# Altium project PCB_Project.PrjPcb
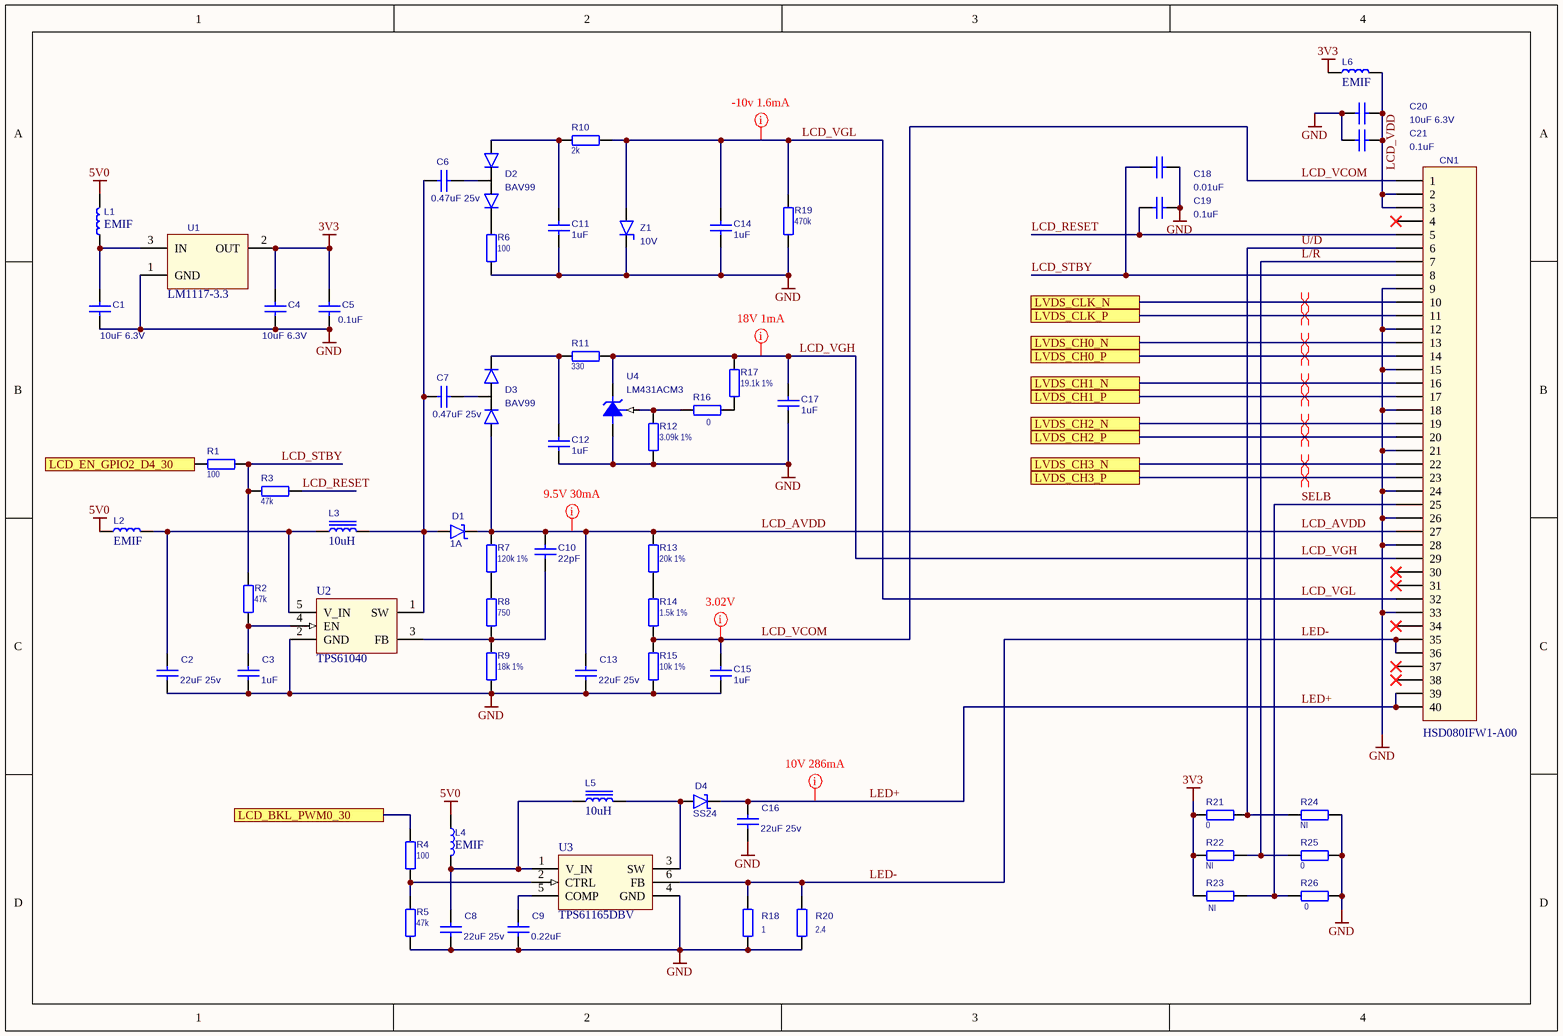
[diagram p0: panel_power_backlight.SchDoc]
4 sheets, 156 parts. Net scope: flat (ports and power ports of the same name join across sheets).
Board file: PCB.PcbDoc
Sheets:
  panel_power_backlight.SchDoc
  mipi_to_lvds.SchDoc
  touch_panel.SchDoc
  mcu_mic_amp_connector.SchDoc

## Sheet panel_power_backlight.SchDoc
size A4

### Parts
C1  value 10uF 6.3V  [C0603]  (hidden comment: CC0603MRX5R5BB106)
C2  value 22uF 25v  [C0805]  (hidden comment: CL21A226MAQNNNE)
C3  value 1uF  [C0603]  (hidden comment: CC0603KRX7R9BB105)
C4  value 10uF 6.3V  [C0603]  (hidden comment: CC0603MRX5R5BB106)
C5  value 0.1uF  [C0603]  (hidden comment: C1608X7R1H104K080AA)
C6  value 0.47uF 25v  [C0603]  (hidden comment: GRM188R71E474KA12D)
C7  value 0.47uF 25v  [C0603]  (hidden comment: GRM188R71E474KA12D)
C8  value 22uF 25v  [C0805]  (hidden comment: CL21A226MAQNNNE)
C9  value 0.22uF  [C0603]  (hidden comment: CC0603ZRY5V8BB224)
C10  value 22pF  [C0603]  (hidden comment: CL10C220JB8NNNC)
C11  value 1uF  [C0603]  (hidden comment: CC0603KRX7R9BB105)
C12  value 1uF  [C0603]  (hidden comment: CC0603KRX7R9BB105)
C13  value 22uF 25v  [C0805]  (hidden comment: CL21A226MAQNNNE)
C14  value 1uF  [C0603]  (hidden comment: CC0603KRX7R9BB105)
C15  value 1uF  [C0603]  (hidden comment: CC0603KRX7R9BB105)
C16  value 22uF 25v  [C0805]  (hidden comment: CL21A226MAQNNNE)
C17  value 1uF  [C0603]  (hidden comment: CC0603KRX7R9BB105)
C18  value 0.01uF  [C0603]  (hidden comment: CL10B103KB8NNNC)
C19  value 0.1uF  [C0603]  (hidden comment: C1608X7R1H104K080AA)
C20  value 10uF 6.3V  [C0603]  (hidden comment: CC0603MRX5R5BB106)
C21  value 0.1uF  [C0603]  (hidden comment: C1608X7R1H104K080AA)
CN1  value HSD080IFW1-A00  [40S-0.5SH]  (hidden comment: FH12-40)
D1  value 1A  [SOD-323]  (hidden comment: PMEG2010EJ.115)
D2  value BAV99  [SOT-23-3]  (hidden comment: BAV99.215)
D3  value BAV99  [SOT-23-3]  (hidden comment: BAV99.215)
D4  SS24  [SMA]
L1  value EMIF  [IND0805]  (hidden comment: BLM21PG221SN1D)
L2  value EMIF  [IND0805]  (hidden comment: BLM21PG221SN1D)
L3  value 10uH  [CDRH3D16]  (hidden comment: CDRH3D16NP-100NC)
L4  value EMIF  [IND0805]  (hidden comment: BLM21PG221SN1D)
L5  value 10uH  [CDRH6D28]  (hidden comment: CDRH6D28-100NC)
L6  value EMIF  [IND0805]  (hidden comment: BLM21PG221SN1D)
R1  100  [R0603]
R2  47k  [R0603]
R3  47k  [R0603]
R4  100  [R0603]
R5  47k  [R0603]
R6  100  [R0603]
R7  value 120k 1%  [R0603]  (hidden comment: 120k)
R8  750  [R0603]
R9  value 18k 1%  [R0603]  (hidden comment: 18k)
R10  2k  [R0603]
R11  330  [R0603]
R12  value 3.09k 1%  [R0603]  (hidden comment: 3.09k)
R13  value 20k 1%  [R0603]  (hidden comment: RC0603FR-0720KL)
R14  value 1.5k 1%  [R0603]  (hidden comment: RC0603FR-071K5L)
R15  value 10k 1%  [R0603]  (hidden comment: RC0603FR-0710KL)
R16  0  [R0603]
R17  19.1k 1%  [R0603]
R18  value 1  [R0805]  (hidden comment: RC0805FR-071RL)
R19  470k  [R0603]
R20  value 2.4  [R0805]  (hidden comment: RES 0805 2R4 5%)
R21  0  [R0603]
R22  value NI  [R0603]  (hidden comment: DNI)
R23  value NI  [R0603]  (hidden comment: DNI)
R24  value NI  [R0603]  (hidden comment: DNI)
R25  0  [R0603]
R26  0  [R0603]
U1  value LM1117-3.3  [SOT-223]  (hidden comment: LM1117)
U2  TPS61040  [SOT-23-5]
U3  value TPS61165DBV  [SOT-23-6]  (hidden comment: TPS61165)
U4  LM431ACM3  [SOT-23-3]
Z1  value 10V  [SOD-80C]  (hidden comment: BZV55-C10.115)

### Ports
LCD_BKL_PWM0_30, LCD_EN_GPIO2_D4_30, LVDS_CH0_N, LVDS_CH0_P, LVDS_CH1_N, LVDS_CH1_P, LVDS_CH2_N, LVDS_CH2_P, LVDS_CH3_N, LVDS_CH3_P, LVDS_CLK_N, LVDS_CLK_P

### Nets
3V3: C4.1 C5.2 L6.1 R21.1 R22.1 R23.1 U1.2(OUT)
5V0: L1.2 L2.2 L4.2
GND: C1.2 C2.1 C3.1 C4.2 C5.1 C8.1 C9.1 C11.1 C12.1 C13.1 C14.1 C15.1 C16.1 C17.1 C18.1 C19.1 C20.1 C21.2 CN1.9 CN1.12 CN1.15 CN1.18 CN1.21 CN1.24 CN1.26 CN1.28 CN1.33 R5.1 R6.2 R9.1 R12.1 R15.1 R18.1 R19.1 R20.1 R24.2 R25.2 R26.2 U1.1(GND) U2.2(GND) U3.4(GND) U4.3(A) Z1.2(K)
L/R: CN1.7 R22.2 R25.1
LCD_AVDD: C10.1 C13.2 CN1.27 D1.2(K) D3.1(A) R7.2 R13.2
LCD_BKL_PWM0_30: R4.2 ; port LCD_BKL_PWM0_30
LCD_EN_GPIO2_D4_30: R1.2 ; port LCD_EN_GPIO2_D4_30
LCD_RESET: C19.2 CN1.5 R3.1
LCD_STBY: C18.2 CN1.8 R1.1 R2.2 R3.2
LCD_VCOM: C15.2 CN1.1 R14.1 R15.2
LCD_VDD: C20.2 C21.1 CN1.2 CN1.3 L6.2
LCD_VGH: C17.2 CN1.29 R11.2 R17.2 U4.1(K)
LCD_VGL: C14.2 CN1.32 R10.2 R19.2 Z1.1(A)
LED+: C16.2 CN1.39 CN1.40 D4.2(K)
LED-: CN1.35 CN1.36 R18.2 R20.2 U3.6(FB)
LVDS_CH0_N: CN1.13 ; port LVDS_CH0_N
LVDS_CH0_P: CN1.14 ; port LVDS_CH0_P
LVDS_CH1_N: CN1.16 ; port LVDS_CH1_N
LVDS_CH1_P: CN1.17 ; port LVDS_CH1_P
LVDS_CH2_N: CN1.19 ; port LVDS_CH2_N
LVDS_CH2_P: CN1.20 ; port LVDS_CH2_P
LVDS_CH3_N: CN1.22 ; port LVDS_CH3_N
LVDS_CH3_P: CN1.23 ; port LVDS_CH3_P
LVDS_CLK_N: CN1.10 ; port LVDS_CLK_N
LVDS_CLK_P: CN1.11 ; port LVDS_CLK_P
SELB: CN1.25 R23.2 R26.1
U/D: CN1.6 R21.2 R24.1
NetC1_1: C1.1 L1.1 U1.3(IN)
NetC2_2: C2.2 L2.1 L3.1 U2.5(V_IN)
NetC3_2: C3.2 R2.1 U2.4(EN)
NetC6_1: C6.1 D2.3(A+K)
NetC6_2: C6.2 C7.2 D1.1(A) L3.2 U2.1(SW)
NetC7_1: C7.1 D3.3(A+K)
NetC8_2: C8.2 L4.1 L5.1 U3.1(V_IN)
NetC9_2: C9.2 U3.5(COMP)
NetC10_2: C10.2 R8.1 R9.2 U2.3(FB)
NetC11_2: C11.2 D2.1(A) R10.1
NetC12_2: C12.2 D3.2(K) R11.1
NetD2_2: D2.2(K) R6.1
NetD4_1: D4.1(A) L5.2 U3.3(SW)
NetR4_1: R4.1 R5.2 U3.2(CTRL)
NetR7_1: R7.1 R8.2
NetR12_2: R12.2 R16.2 U4.2(REF)
NetR13_1: R13.1 R14.2
NetR16_1: R16.1 R17.1

Not connected (* = marked no-connect by the designer): CN1 4* 30* 31* 34* 37* 38*

### Layout directives
mark named 10V 286mA: LED+
mark named 9.5V 30mA: LCD_AVDD
mark named -10v 1.6mA: LCD_VGL
mark named 18V 1mA: LCD_VGH
mark named 3.02V: LCD_VCOM
differential pair: LVDS_CH0_N, LVDS_CH0_P, LVDS_CH1_N, LVDS_CH1_P, LVDS_CH2_N, LVDS_CH2_P, LVDS_CH3_N, LVDS_CH3_P, LVDS_CLK_N, LVDS_CLK_P

### Library data of the parts
C1-C21 = CAP_NPOL
CN1 = FH12-40: DT38
D1 D4 = SHOTTKY
  D4: Value: SS24
D2 D3 = DIODE_DUAL_1: Dual series 1
L1 L2 L4 L6 = IND_WO_IRON
L3 L5 = IND_W_IRON
R1 R4 = RESISTOR: Value: 100
R2 R3 R5-R26 = RESISTOR: RES
  R2 R3 R5: Value: 47k
  R6: Value: 100
  R8: Value: 750
  R10: Value: 2k
  R11: Value: 330
  R16 R21 R25 R26: Value: 0
  R17: Value: 19.1k 1%
  R19: Value: 470k
U2 = TPS6104x
U3 = TPS61165DBV: TPS61165DBV (SOT-23-6 package)
U4 = LM431ACM3: Adjustable Precision Zener Shunt Regulator, 3-pin SOT-23; Manufacturer: National Semiconductor; PackageTopMarking: N1F*XTT; PowerWise: N; CompType: MiscPower; Published: 4-Dec-2008; DatasheetVersion: Mar-2005; PackageVersion: revB, Mar-2003; PackageReference: MF03A; Publisher: Altium Limited; PackageDescription: Molded SOT-23, .115 x .051 x .037in Body, 3 Lead, .075 in Pitch; Supplier 1: Farnell; Supplier Part Number 1: 1215209; PartNumber: LM431ACM3; RoHS: N; PinCount: 3; ComponentLink1Description: LM431 Datasheet; ComponentLink1URL: http://www.national.com/ds/LM/LM431.pdf; ComponentLink2Description: LM431 Web Page; ComponentLink2URL: http://www.national.com/pf/LM/LM431.html; ComponentLink3Description: MF03A Package Page; ComponentLink3URL: http://www.national.com/packaging/folders/mf03a.html
Z1 = ZENNER

## Sheet mipi_to_lvds.SchDoc
size A4
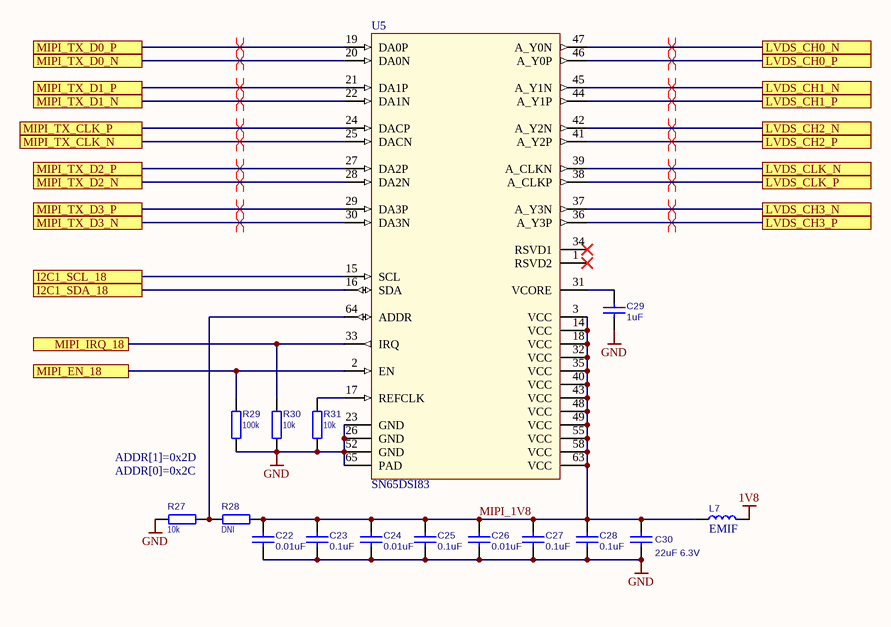
[diagram p1: mipi_to_lvds.SchDoc]

### Parts
C22  value 0.01uF  [C0603]  (hidden comment: CL10B103KB8NNNC)
C23  value 0.1uF  [C0603]  (hidden comment: C1608X7R1H104K080AA)
C24  value 0.01uF  [C0603]  (hidden comment: CL10B103KB8NNNC)
C25  value 0.1uF  [C0603]  (hidden comment: C1608X7R1H104K080AA)
C26  value 0.01uF  [C0603]  (hidden comment: CL10B103KB8NNNC)
C27  value 0.1uF  [C0603]  (hidden comment: C1608X7R1H104K080AA)
C28  value 0.1uF  [C0603]  (hidden comment: C1608X7R1H104K080AA)
C29  value 1uF  [C0603]  (hidden comment: CL21B105KAFNNNE)
C30  value 22uF 6.3V  [C0805]  (hidden comment: CL21A226MQQNNNE)
L7  value EMIF  [IND0805]  (hidden comment: BLM21PG221SN1D)
R27  10k  [R0603]
R28  DNI  [R0603]
R29  value 100k  [R0603]  (hidden comment: 10k)
R30  10k  [R0603]
R31  10k  [R0603]
U5  SN65DSI83  [HPM064_N]

### Ports
I2C1_SCL_18, I2C1_SDA_18, LVDS_CH0_N, LVDS_CH0_P, LVDS_CH1_N, LVDS_CH1_P, LVDS_CH2_N, LVDS_CH2_P, LVDS_CH3_N, LVDS_CH3_P, LVDS_CLK_N, LVDS_CLK_P, MIPI_EN_18, MIPI_IRQ_18, MIPI_TX_CLK_N, MIPI_TX_CLK_P, MIPI_TX_D0_N, MIPI_TX_D0_P, MIPI_TX_D1_N, MIPI_TX_D1_P, MIPI_TX_D2_N, MIPI_TX_D2_P, MIPI_TX_D3_N, MIPI_TX_D3_P

### Nets
1V8: L7.2
GND: C22.2 C23.1 C24.2 C25.1 C26.2 C27.1 C28.1 C29.1 C30.1 R27.1 R29.1 R30.1 R31.1 U5.23(GND) U5.26(GND) U5.52(GND) U5.65(PAD)
I2C1_SCL_18: U5.15(SCL) ; port I2C1_SCL_18
I2C1_SDA_18: U5.16(SDA) ; port I2C1_SDA_18
LVDS_CH0_N: U5.47(A_Y0N) ; port LVDS_CH0_N
LVDS_CH0_P: U5.46(A_Y0P) ; port LVDS_CH0_P
LVDS_CH1_N: U5.45(A_Y1N) ; port LVDS_CH1_N
LVDS_CH1_P: U5.44(A_Y1P) ; port LVDS_CH1_P
LVDS_CH2_N: U5.42(A_Y2N) ; port LVDS_CH2_N
LVDS_CH2_P: U5.41(A_Y2P) ; port LVDS_CH2_P
LVDS_CH3_N: U5.37(A_Y3N) ; port LVDS_CH3_N
LVDS_CH3_P: U5.36(A_Y3P) ; port LVDS_CH3_P
LVDS_CLK_N: U5.39(A_CLKN) ; port LVDS_CLK_N
LVDS_CLK_P: U5.38(A_CLKP) ; port LVDS_CLK_P
MIPI_1V8: C22.1 C23.2 C24.1 C25.2 C26.1 C27.2 C28.2 C30.2 L7.1 R28.2 U5.3(VCC) U5.14(VCC) U5.18(VCC) U5.32(VCC) U5.35(VCC) U5.40(VCC) U5.43(VCC) U5.48(VCC) U5.49(VCC) U5.55(VCC) U5.58(VCC) U5.63(VCC)
MIPI_EN_18: R29.2 U5.2(EN) ; port MIPI_EN_18
MIPI_IRQ_18: R30.2 U5.33(IRQ) ; port MIPI_IRQ_18
MIPI_TX_CLK_N: U5.25(DACN) ; port MIPI_TX_CLK_N
MIPI_TX_CLK_P: U5.24(DACP) ; port MIPI_TX_CLK_P
MIPI_TX_D0_N: U5.20(DA0N) ; port MIPI_TX_D0_N
MIPI_TX_D0_P: U5.19(DA0P) ; port MIPI_TX_D0_P
MIPI_TX_D1_N: U5.22(DA1N) ; port MIPI_TX_D1_N
MIPI_TX_D1_P: U5.21(DA1P) ; port MIPI_TX_D1_P
MIPI_TX_D2_N: U5.28(DA2N) ; port MIPI_TX_D2_N
MIPI_TX_D2_P: U5.27(DA2P) ; port MIPI_TX_D2_P
MIPI_TX_D3_N: U5.30(DA3N) ; port MIPI_TX_D3_N
MIPI_TX_D3_P: U5.29(DA3P) ; port MIPI_TX_D3_P
NetC29_2: C29.2 U5.31(VCORE)
NetR27_2: R27.2 R28.1 U5.64(ADDR)
NetR31_2: R31.2 U5.17(REFCLK)

Not connected (* = marked no-connect by the designer): U5 1(RSVD2)* 34(RSVD1)*

### Layout directives
differential pair: LVDS_CH0_N, LVDS_CH0_P, LVDS_CH1_N, LVDS_CH1_P, LVDS_CH2_N, LVDS_CH2_P, LVDS_CH3_N, LVDS_CH3_P, LVDS_CLK_N, LVDS_CLK_P, MIPI_TX_CLK_N, MIPI_TX_CLK_P, MIPI_TX_D0_N, MIPI_TX_D0_P, MIPI_TX_D1_N, MIPI_TX_D1_P, MIPI_TX_D2_N, MIPI_TX_D2_P, MIPI_TX_D3_N, MIPI_TX_D3_P

### Notes on the sheet
- ADDR[1]=0x2D
- ADDR[0]=0x2C

### Library data of the parts
C22-C30 = CAP_NPOL
L7 = IND_WO_IRON
R27-R31 = RESISTOR: RES
  R27 R30 R31: Value: 10k
  R28: Value: DNI
U5 = SN65DSI83: Single-Channel MIPI® DSI to Single-Link LVDS Bridge; value: SN65DSI83

## Sheet touch_panel.SchDoc
size A4
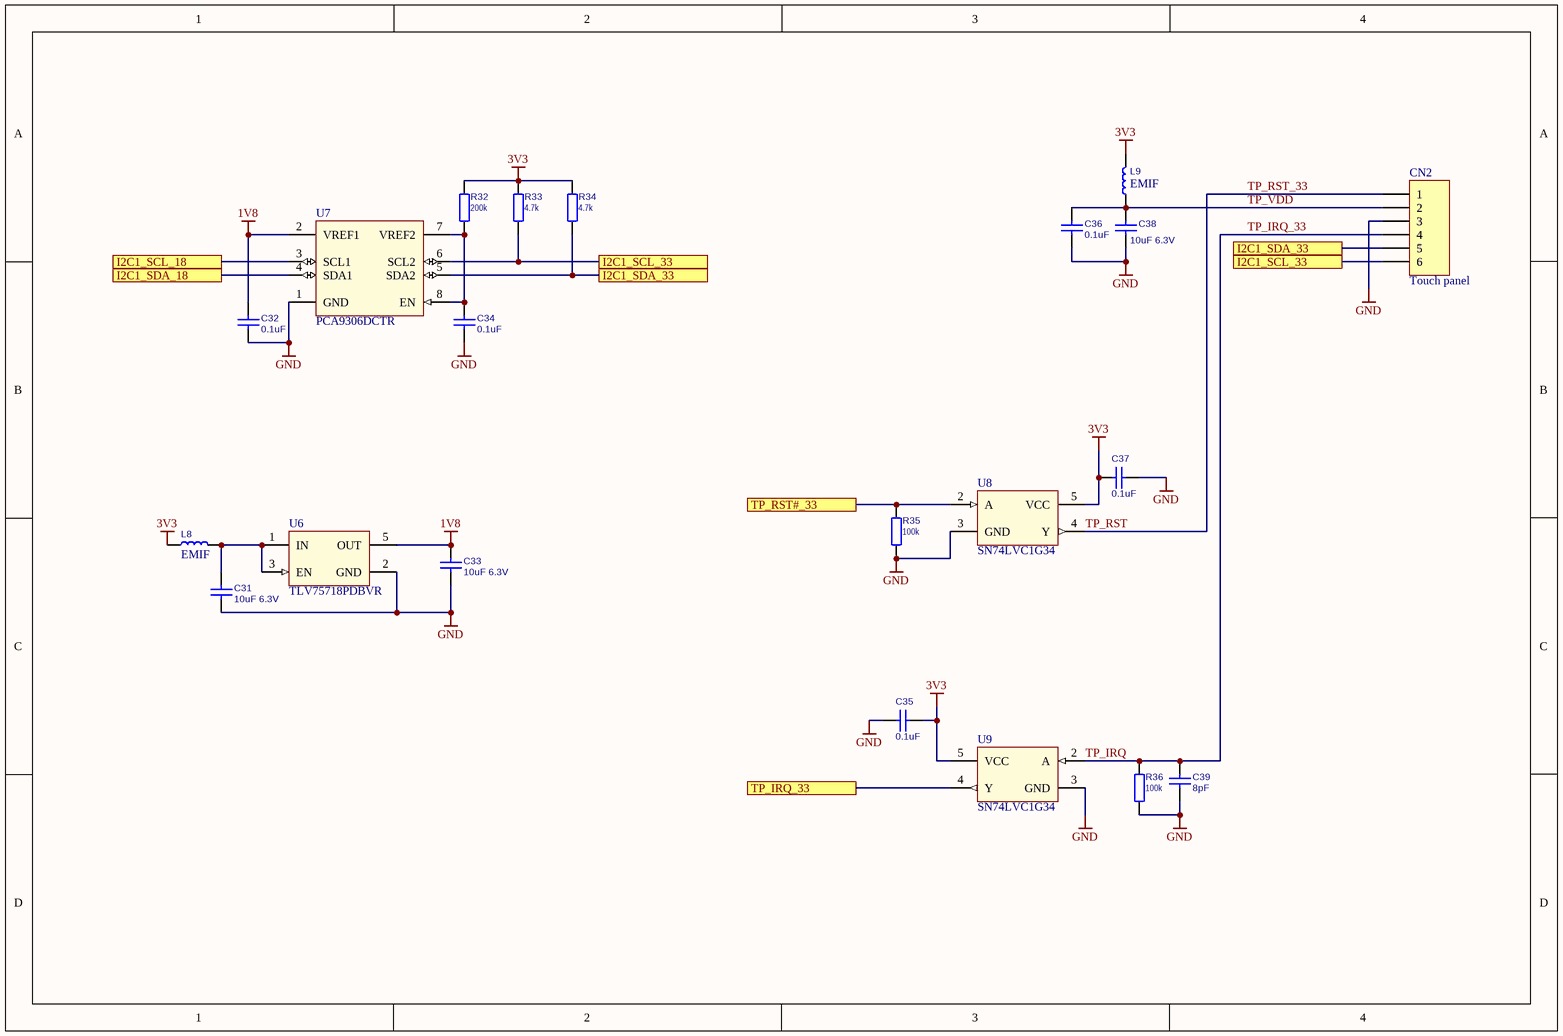
[diagram p2: touch_panel.SchDoc]

### Parts
C31  value 10uF 6.3V  [C0603]  (hidden comment: CC0603MRX5R5BB106)
C32  value 0.1uF  [C0603]  (hidden comment: C1608X7R1H104K080AA)
C33  value 10uF 6.3V  [C0603]  (hidden comment: CC0603MRX5R5BB106)
C34  value 0.1uF  [C0603]  (hidden comment: C1608X7R1H104K080AA)
C35  value 0.1uF  [C0603]  (hidden comment: C1608X7R1H104K080AA)
C36  value 0.1uF  [C0603]  (hidden comment: C1608X7R1H104K080AA)
C37  value 0.1uF  [C0603]  (hidden comment: C1608X7R1H104K080AA)
C38  value 10uF 6.3V  [C0603]  (hidden comment: CC0603MRX5R5BB106)
C39  value 8pF  [C0603]  (hidden comment: GRM1885C1H8R0DA01D)
CN2  Touch panel  [6S-0.5SH]
L8  value EMIF  [IND0603]  (hidden comment: BLM18AG102SN1D)
L9  value EMIF  [IND0603]  (hidden comment: BLM18AG102SN1D)
R32  200k  [R0603]
R33  4.7k  [R0603]
R34  4.7k  [R0603]
R35  value 100k  [R0603]  (hidden comment: 47k)
R36  value 100k  [R0603]  (hidden comment: 47k)
U6  TLV75718PDBVR  [SOT-23-5]
U7  PCA9306DCTR  [PSOP-8]
U8  SN74LVC1G34  [SOT-23-5]
U9  SN74LVC1G34  [SOT-23-5]

### Ports
I2C1_SCL_18, I2C1_SCL_33, I2C1_SDA_18, I2C1_SDA_33, TP_IRQ_33, TP_RST#_33

### Nets
1V8: C32.1 C33.1 U6.5(OUT) U7.2(VREF1)
3V3: C35.1 C37.1 L8.1 L9.2 R32.1 R33.1 R34.1 U8.5(VCC) U9.5(VCC)
GND: C31.2 C32.2 C33.2 C34.1 C35.2 C36.2 C37.2 C38.2 C39.2 CN2.3 R35.1 R36.1 U6.2(GND) U7.1(GND) U8.3(GND) U9.3(GND)
I2C1_SCL_18: U7.3(SCL1) ; port I2C1_SCL_18
I2C1_SCL_33: CN2.6 R33.2 U7.6(SCL2) ; port I2C1_SCL_33
I2C1_SDA_18: U7.4(SDA1) ; port I2C1_SDA_18
I2C1_SDA_33: CN2.5 R34.2 U7.5(SDA2) ; port I2C1_SDA_33
TP_IRQ: C39.1 CN2.4 R36.2 U9.2(A)  [also labelled TP_IRQ_33]
TP_IRQ_33: U9.4(Y) ; port TP_IRQ_33
TP_RST: CN2.1 U8.4(Y)  [also labelled TP_RST_33]
TP_RST#_33: R35.2 U8.2(A) ; port TP_RST#_33
TP_VDD: C36.1 C38.1 CN2.2 L9.1
NetC31_1: C31.1 L8.2 U6.1(IN) U6.3(EN)
NetC34_2: C34.2 R32.2 U7.7(VREF2) U7.8(EN)

### Library data of the parts
C31-C39 = CAP_NPOL
CN2 = Header 6: Header, 6-Pin; LatestRevisionDate: 17-Jul-2002; LatestRevisionNote: Re-released for DXP Platform.; Publisher: Altium Limited
L8 L9 = IND_WO_IRON
R32-R36 = RESISTOR: RES
  R32: Value: 200k
  R33 R34: Value: 4.7k
U6 = TLV733P: Capacitor-Free, 300-mA, Low-Dropout Regulator with Foldback Current Limit for Portable Devices; value: TLV733P
U7 = PCA9306: PCA9306 Dual Bidirectional I2C Bus and SMBus Voltage-Level Translator; value: PCA9306DCTR
U8 U9 = SN74LVC1G34: Single Buffer Gate; value: SN74LVC1G34

## Sheet mcu_mic_amp_connector.SchDoc
size A4
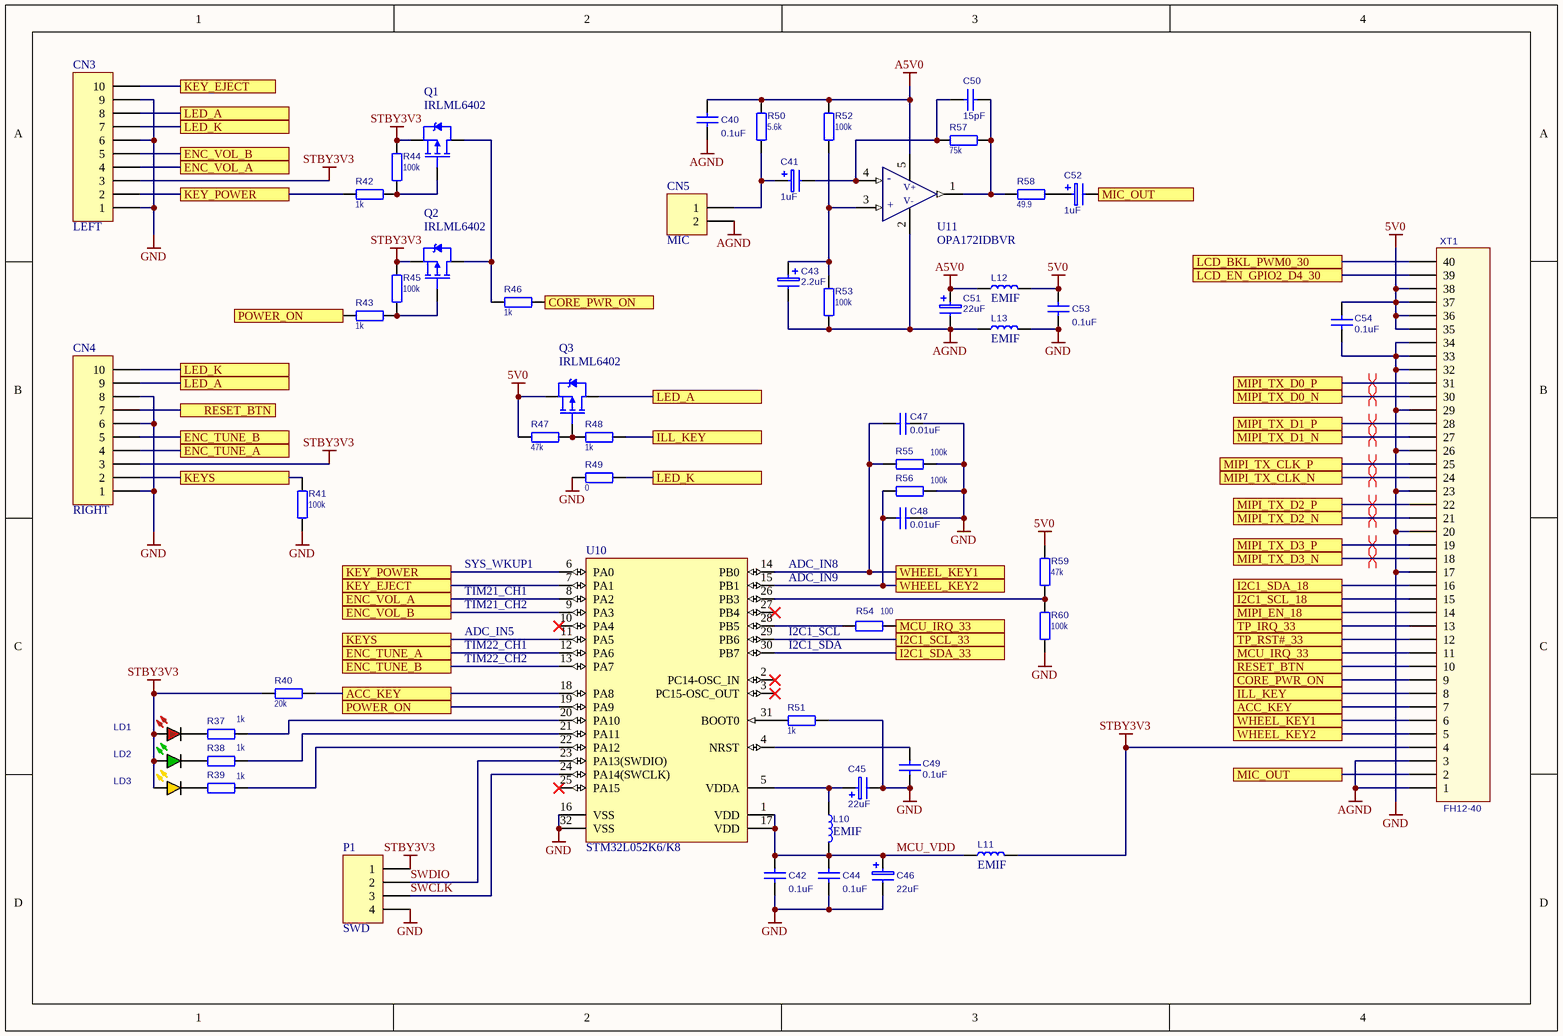
[diagram p3: mcu_mic_amp_connector.SchDoc]

### Parts
C40  value 0.1uF  [C0603]  (hidden comment: CC0603KRX7R9BB104)
C41  value 1uF  [TANTAL-A-1206]  (hidden comment: 293D105X9035A2TE3)
C42  value 0.1uF  [C0603]  (hidden comment: CC0603KRX7R9BB104)
C43  value 2.2uF  [TANTAL-A-1206]  (hidden comment: 293D225X9010A2TE3)
C44  value 0.1uF  [C0603]  (hidden comment: CC0603KRX7R9BB104)
C45  value 22uF  [TANTAL-A-1206]  (hidden comment: 293D226X9010A2TE3)
C46  value 22uF  [TANTAL-A-1206]  (hidden comment: 293D226X9010A2TE3)
C47  value 0.01uF  [C0603]  (hidden comment: CL10B103KB8NNNC)
C48  value 0.01uF  [C0603]  (hidden comment: CL10B103KB8NNNC)
C49  value 0.1uF  [C0603]  (hidden comment: CC0603KRX7R9BB104)
C50  value 15pF  [C0603]  (hidden comment: CC0603GRNPO9BN150)
C51  value 22uF  [TANTAL-A-1206]  (hidden comment: 293D226X9010A2TE3)
C52  value 1uF  [TANTAL-A-1206]  (hidden comment: 293D105X9035A2TE3)
C53  value 0.1uF  [C0603]  (hidden comment: CC0603KRX7R9BB104)
C54  value 0.1uF  [C0603]  (hidden comment: C1608X7R1H104K080AA)
CN3  LEFT  [10S-0.5SH]
CN4  RIGHT  [10S-0.5SH]
CN5  MIC  [MW-2M]
L10  value EMIF  [IND0603]  (hidden comment: BLM18AG102SN1D)
L11  value EMIF  [IND0603]  (hidden comment: BLM18AG102SN1D)
L12  value EMIF  [IND0603]  (hidden comment: BLM18AG102SN1D)
L13  value EMIF  [IND0603]  (hidden comment: BLM18AG102SN1D)
LD1  FYLS-0603URC  [LED0603]  (value not drawn)
LD2  KPT-1608SGC  [LED0603]  (value not drawn)
LD3  FYLS-0603UYC  [LED0603]  (value not drawn)
P1  SWD  [PLS-4]
Q1  IRLML6402  [SOT-23-3]
Q2  IRLML6402  [SOT-23-3]
Q3  IRLML6402  [SOT-23-3]
R37  1k  [R0603]
R38  1k  [R0603]
R39  1k  [R0603]
R40  20k  [R0603]
R41  100k  [R0603]
R42  1k  [R0603]
R43  1k  [R0603]
R44  100k  [R0603]
R45  100k  [R0603]
R46  1k  [R0603]
R47  47k  [R0603]
R48  1k  [R0603]
R49  0  [R0805]
R50  5.6k  [R0603]
R51  1k  [R0603]
R52  100k  [R0603]
R53  100k  [R0603]
R54  100  [R0603]
R55  100k  [R0603]
R56  100k  [R0603]
R57  75k  [R0603]
R58  49.9  [R0603]
R59  47k  [R0603]
R60  100k  [R0603]
U10  STM32L052K6/K8  [STM-LQFP32_N]
U11  OPA172IDBVR  [SOT-23-5]
XT1  FH12-40  [40S-0.5SH]

### Ports
ACC_KEY, CORE_PWR_ON, ENC_TUNE_A, ENC_TUNE_B, ENC_VOL_A, ENC_VOL_B, I2C1_SCL_18, I2C1_SCL_33, I2C1_SDA_18, I2C1_SDA_33, ILL_KEY, KEY_EJECT, KEY_POWER, KEYS, LCD_BKL_PWM0_30, LCD_EN_GPIO2_D4_30, LED_A, LED_K, MCU_IRQ_33, MIC_OUT, MIPI_EN_18, MIPI_TX_CLK_N, MIPI_TX_CLK_P, MIPI_TX_D0_N, MIPI_TX_D0_P, MIPI_TX_D1_N, MIPI_TX_D1_P, MIPI_TX_D2_N, MIPI_TX_D2_P, MIPI_TX_D3_N, MIPI_TX_D3_P, POWER_ON, RESET_BTN, TP_IRQ_33, TP_RST#_33, WHEEL_KEY1, WHEEL_KEY2

### Nets
5V0: C53.1 C54.2 L12.2 Q3.2(S) R47.1 R59.2 XT1.35 XT1.36 XT1.37 XT1.38
A5V0: C40.1 C51.1(+) L12.1 R50.1 R52.1 U11.5(V+)
AGND: C40.2 C43.2(-) C51.2(-) CN5.2 L13.1 R53.2 U11.2(V-) XT1.1 XT1.3
GND: C42.2 C44.2 C45.2(-) C46.2(-) C47.1 C48.1 C49.1 C53.2 C54.1 CN3.1 CN3.6 CN3.9 CN4.1 CN4.6 CN4.8 L13.2 P1.4 R41.1 R49.1 R51.2 R55.2 R56.2 R60.2 U10.16(VSS) U10.32(VSS) XT1.17 XT1.20 XT1.23 XT1.26 XT1.29 XT1.32 XT1.33 XT1.34
STBY3V3: CN3.3 CN4.3 L11.2 LD1.2 LD2.2 LD3.2 P1.1 Q1.2(S) Q2.2(S) R40.2 R44.2 R45.2 XT1.4
ACC_KEY: R40.1 U10.18(PA8) XT1.7 ; port ACC_KEY
CORE_PWR_ON: R46.1 XT1.9 ; port CORE_PWR_ON
ENC_TUNE_A: CN4.4 U10.12(PA6) ; port ENC_TUNE_A
ENC_TUNE_B: CN4.5 U10.13(PA7) ; port ENC_TUNE_B
ENC_VOL_A: CN3.4 U10.8(PA2) ; port ENC_VOL_A
ENC_VOL_B: CN3.5 U10.9(PA3) ; port ENC_VOL_B
I2C1_SCL_18: XT1.15 ; port I2C1_SCL_18
I2C1_SCL_33: U10.29(PB6) ; port I2C1_SCL_33
I2C1_SDA_18: XT1.16 ; port I2C1_SDA_18
I2C1_SDA_33: U10.30(PB7) ; port I2C1_SDA_33
ILL_KEY: R48.2 XT1.8 ; port ILL_KEY
KEY_EJECT: CN3.10 U10.7(PA1) ; port KEY_EJECT
KEY_POWER: CN3.2 R42.1 U10.6(PA0) ; port KEY_POWER
KEYS: CN4.2 R41.2 U10.11(PA5) ; port KEYS
LCD_BKL_PWM0_30: XT1.40 ; port LCD_BKL_PWM0_30
LCD_EN_GPIO2_D4_30: XT1.39 ; port LCD_EN_GPIO2_D4_30
LED_A: CN3.8 CN4.9 Q3.3(D) ; port LED_A
LED_K: CN3.7 CN4.10 R49.2 ; port LED_K
MCU_IRQ_33: R54.2 XT1.11 ; port MCU_IRQ_33
MCU_VDD: C42.1 C44.1 C46.1(+) L10.2 L11.1 U10.1(VDD) U10.17(VDD)
MIC_OUT: C52.2(-) XT1.2 ; port MIC_OUT
MIPI_EN_18: XT1.14 ; port MIPI_EN_18
MIPI_TX_CLK_N: XT1.24 ; port MIPI_TX_CLK_N
MIPI_TX_CLK_P: XT1.25 ; port MIPI_TX_CLK_P
MIPI_TX_D0_N: XT1.30 ; port MIPI_TX_D0_N
MIPI_TX_D0_P: XT1.31 ; port MIPI_TX_D0_P
MIPI_TX_D1_N: XT1.27 ; port MIPI_TX_D1_N
MIPI_TX_D1_P: XT1.28 ; port MIPI_TX_D1_P
MIPI_TX_D2_N: XT1.21 ; port MIPI_TX_D2_N
MIPI_TX_D2_P: XT1.22 ; port MIPI_TX_D2_P
MIPI_TX_D3_N: XT1.18 ; port MIPI_TX_D3_N
MIPI_TX_D3_P: XT1.19 ; port MIPI_TX_D3_P
POWER_ON: R43.2 U10.19(PA9) ; port POWER_ON
RESET_BTN: CN4.7 XT1.10 ; port RESET_BTN
SWCLK: P1.3 U10.24(PA14(SWCLK))
SWDIO: P1.2 U10.23(PA13(SWDIO))
TP_IRQ_33: XT1.13 ; port TP_IRQ_33
TP_RST#_33: XT1.12 ; port TP_RST#_33
WHEEL_KEY1: C47.2 R55.1 U10.14(PB0) XT1.6 ; port WHEEL_KEY1
WHEEL_KEY2: C48.2 R56.1 U10.15(PB1) XT1.5 ; port WHEEL_KEY2
NetC41_1: C41.1(+) CN5.1 R50.2
NetC41_2: C41.2(-) C50.1 R57.2 U11.4(-)
NetC43_1: C43.1(+) R52.2 R53.1 U11.3(+)
NetC45_1: C45.1(+) L10.1 U10.5(VDDA)
NetC49_2: C49.2 U10.4(NRST)
NetC50_2: C50.2 R57.1 R58.1 U11.1
NetC52_1: C52.1(+) R58.2
NetLD1_1: LD1.1 R37.1
NetLD2_1: LD2.1 R38.1
NetLD3_1: LD3.1 R39.1
NetQ1_1: Q1.1(G) R42.2 R44.1
NetQ1_3: Q1.3(D) Q2.3(D) R46.2
NetQ2_1: Q2.1(G) R43.1 R45.1
NetQ3_1: Q3.1(G) R47.2 R48.1
NetR37_2: R37.2 U10.20(PA10)
NetR38_2: R38.2 U10.21(PA11)
NetR39_2: R39.2 U10.22(PA12)
NetR51_1: R51.1 U10.31(BOOT0)
NetR54_1: R54.1 U10.28(PB5)
NetR59_1: R59.1 R60.1 U10.26(PB3)

Not connected (* = marked no-connect by the designer): U10 2(PC14-OSC_IN)* 3(PC15-OSC_OUT)* 10(PA4)* 25(PA15)* 27(PB4)*

### Layout directives
differential pair: MIPI_TX_CLK_N, MIPI_TX_CLK_P, MIPI_TX_D0_N, MIPI_TX_D0_P, MIPI_TX_D1_N, MIPI_TX_D1_P, MIPI_TX_D2_N, MIPI_TX_D2_P, MIPI_TX_D3_N, MIPI_TX_D3_P

### Notes on the sheet
- SYS_WKUP1
- ADC_IN9
- ADC_IN8
- TIM21_CH1
- TIM21_CH2
- TIM22_CH1
- ADC_IN5
- (near R54) I2C1_SDA
- (near R54) I2C1_SCL
- TIM22_CH2

### Library data of the parts
C40 C42 C44 C47-C50 C53 C54 = CAP_NPOL
C41 C43 C45 C46 C51 C52 = CAP_POL
CN3 CN4 = HDR 10: Header, 10-Pin; LatestRevisionDate: 17-Jul-2002; LatestRevisionNote: Re-released for DXP Platform.; Publisher: Altium Limited
CN5 = HDR 2: Header, 2-Pin; value: MW-2MR; LatestRevisionDate: 17-Jul-2002; LatestRevisionNote: Re-released for DXP Platform.; Publisher: Altium Limited
L10-L13 = IND_WO_IRON
LD1 = LED_RED: LED Red; Value: *
LD2 = LED_GREEN: LED Green; Value: *
LD3 = LED_YELLOW: LED Yellow; Value: *
P1 = HDR 4: Header, 4-Pin; LatestRevisionDate: 17-Jul-2002; LatestRevisionNote: Re-released for DXP Platform.; Publisher: Altium Limited
Q1-Q3 = P-Channel: HEXFET Power MOSFET
R37-R60 = RESISTOR: RES
  R37-R39 R42 R43 R46 R48 R51: Value: 1k
  R40: Value: 20k
  R41 R44 R45 R52 R53 R55 R56 R60: Value: 100k
  R47 R59: Value: 47k
  R49: Value: 0
  R50: Value: 5.6k
  R54: Value: 100
  R57: Value: 75k
  R58: Value: 49.9
U10 = STM32L052K6/K8: Ultra-low power ARM Cortex-M0+ MCU with 64 Kbytes Flash, 32 MHz CPU, USB; PartNumber: STM32F050F6P7; FLASH Size (Prog) (kB): 32; I/Os (High Current): 15; Internal RAM Size (kB): 4; Operating Frequency(F) (Processor speed) (MHz): 48; Packing: Tube; Supply Voltage(Vcc) min (V): 2; DatasheetVersion: Rev. 1; PackageVersion: Rev. 1, 11/2012; PackageReference: TSSOP20; PackageDescription: 20-Pin Thin Shrink Small Outline Package, 6.5 x 4.4 mm Body, 0.65 mm Pitch; Supplier 1: Newark; Supplier Part Number 1: 19X6195; Supplier 2: Mouser; Supplier Part Number 2: 511-STM32F050F6P7; Core: ARM Cortex-M0; Mounting Technology: Surface Mount; ComponentLink1Description: Manufacturer URL; ComponentLink1URL: http://www.st.com/web/en/home.html; ComponentLink2Description: Datasheet; ComponentLink2URL: http://www.st.com/st-web-ui/static/active/en/resource/technical/document/datasheet/DM00065136.pdf; ComponentLink3Description: Package Specification; ComponentLink3URL: http://www.st.com/st-web-ui/static/active/en/resource/technical/document/datasheet/DM00065136.pdf
U11 = OPA172IDBVR: OPAx172 36-V, Single-Supply, 10-MHz, Rail-to-Rail Output Operational Amplifiers; value: OPA172IDBVR
XT1 = FH12-40: DT38; Value: *

## Nets that join several sheets
1V8: mipi_to_lvds (L7.2), touch_panel (C32.1 C33.1 U6.5 U7.2)
3V3: panel_power_backlight (7 pins), touch_panel (9 pins)
5V0: panel_power_backlight (L1.2 L2.2 L4.2), mcu_mic_amp_connector (10 pins)
GND: panel_power_backlight (43 pins), mipi_to_lvds (17 pins), touch_panel (16 pins), mcu_mic_amp_connector (33 pins)
I2C1_SCL_18: mipi_to_lvds (U5.15), touch_panel (U7.3), mcu_mic_amp_connector (XT1.15)
I2C1_SCL_33: touch_panel (CN2.6 R33.2 U7.6), mcu_mic_amp_connector (U10.29)
I2C1_SDA_18: mipi_to_lvds (U5.16), touch_panel (U7.4), mcu_mic_amp_connector (XT1.16)
I2C1_SDA_33: touch_panel (CN2.5 R34.2 U7.5), mcu_mic_amp_connector (U10.30)
LCD_BKL_PWM0_30: panel_power_backlight (R4.2), mcu_mic_amp_connector (XT1.40)
LCD_EN_GPIO2_D4_30: panel_power_backlight (R1.2), mcu_mic_amp_connector (XT1.39)
LVDS_CH0_N: panel_power_backlight (CN1.13), mipi_to_lvds (U5.47)
LVDS_CH0_P: panel_power_backlight (CN1.14), mipi_to_lvds (U5.46)
LVDS_CH1_N: panel_power_backlight (CN1.16), mipi_to_lvds (U5.45)
LVDS_CH1_P: panel_power_backlight (CN1.17), mipi_to_lvds (U5.44)
LVDS_CH2_N: panel_power_backlight (CN1.19), mipi_to_lvds (U5.42)
LVDS_CH2_P: panel_power_backlight (CN1.20), mipi_to_lvds (U5.41)
LVDS_CH3_N: panel_power_backlight (CN1.22), mipi_to_lvds (U5.37)
LVDS_CH3_P: panel_power_backlight (CN1.23), mipi_to_lvds (U5.36)
LVDS_CLK_N: panel_power_backlight (CN1.10), mipi_to_lvds (U5.39)
LVDS_CLK_P: panel_power_backlight (CN1.11), mipi_to_lvds (U5.38)
MIPI_EN_18: mipi_to_lvds (R29.2 U5.2), mcu_mic_amp_connector (XT1.14)
MIPI_TX_CLK_N: mipi_to_lvds (U5.25), mcu_mic_amp_connector (XT1.24)
MIPI_TX_CLK_P: mipi_to_lvds (U5.24), mcu_mic_amp_connector (XT1.25)
MIPI_TX_D0_N: mipi_to_lvds (U5.20), mcu_mic_amp_connector (XT1.30)
MIPI_TX_D0_P: mipi_to_lvds (U5.19), mcu_mic_amp_connector (XT1.31)
MIPI_TX_D1_N: mipi_to_lvds (U5.22), mcu_mic_amp_connector (XT1.27)
MIPI_TX_D1_P: mipi_to_lvds (U5.21), mcu_mic_amp_connector (XT1.28)
MIPI_TX_D2_N: mipi_to_lvds (U5.28), mcu_mic_amp_connector (XT1.21)
MIPI_TX_D2_P: mipi_to_lvds (U5.27), mcu_mic_amp_connector (XT1.22)
MIPI_TX_D3_N: mipi_to_lvds (U5.30), mcu_mic_amp_connector (XT1.18)
MIPI_TX_D3_P: mipi_to_lvds (U5.29), mcu_mic_amp_connector (XT1.19)
TP_IRQ_33: touch_panel (U9.4), mcu_mic_amp_connector (XT1.13)
TP_RST#_33: touch_panel (R35.2 U8.2), mcu_mic_amp_connector (XT1.12)